# Altium schematic sheet REGENIX_Convertisseurs.SchDoc
size A4; SheetNumber: 10; SheetTotal: 12
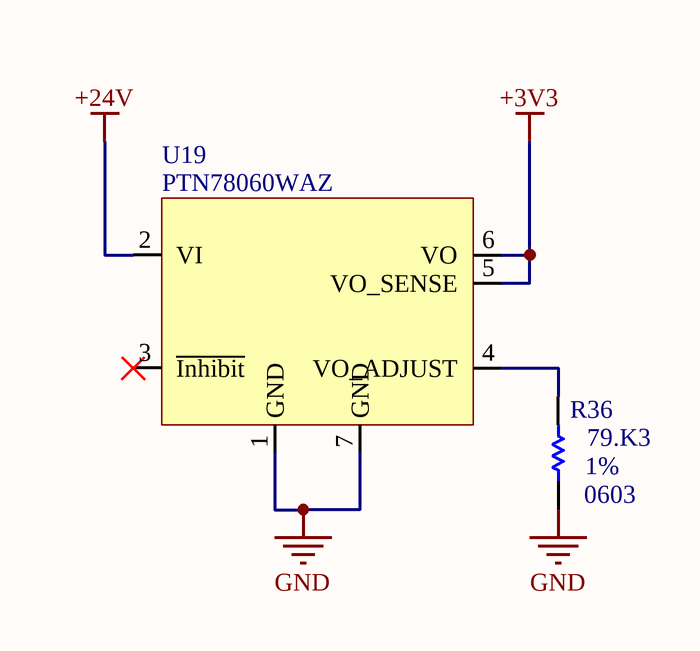
[diagram p0: REGENIX_Convertisseurs.SchDoc]

## Parts
R36  value 79.K3  Package: 0603  Precision: 1%  [RES_0603]  (hidden comment: RES - 0603)
U19  PTN78060WAZ  [REG_SWR_PTN78060WAZ]

## Nets
+3V3: U19.5(VO_SENSE) U19.6(VO)
+24V: U19.2(VI)
GND: R36.1 U19.1(GND) U19.7(GND)
NetR36_2: R36.2 U19.4(VO_ADJUST)

Not connected (* = marked no-connect by the designer): U19 3(~{Inhibit})*

## Library data of the parts
U19 = REG_SWR_PTN78060WAZ: REG - DC-DC Module 2.5V~12.6V ADJ OUT 3A  - 7-SMD; Manufacturer #1: Texas Instruments; Value: 2.5~12.6V (OUT); Tolerance: 3%; Voltage Rating: 7~36V (IN); GRAMS Lib Spec: 2.8; Magnetic Material: Unknown; Polarized: Yes; Current Rating: 3A; Power Max: -; HelpURL: http://www.ti.com/lit/ds/symlink/ptn78060w.pdf; CreatedBy/Date: Danae D-F 28 juin 2019; VerifiedBy: Nicolas V. (2019-07-15); Temperature: -40°C ~ 85°C; Package: 7-SMD; Manufacturer #2: -; Assembly Type: SMD; Part Number #2: -; Part Number #1: PTN78060WAZ; Supplier 1: Digi-Key; Supplier Part Number 1: 296-20525-ND; Cryo: UNKNOWN
R36 = RES - 0603: Current: *; CreatedBy: Jonathan Bouchard